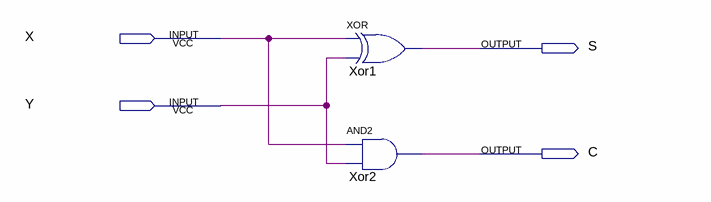
[diagram p0: schematic sheet]
// Quartus schematic half_add.bdf as structural Verilog: 2 symbols, 4 pins
module half_add (
  input  X,
  input  Y,
  output S,
  output C
);

  xor Xor1 (S, X, Y);
  and Xor2 (C, X, Y);
endmodule
